# EAGLE design AdaPoon (EAGLE 8.6.3)
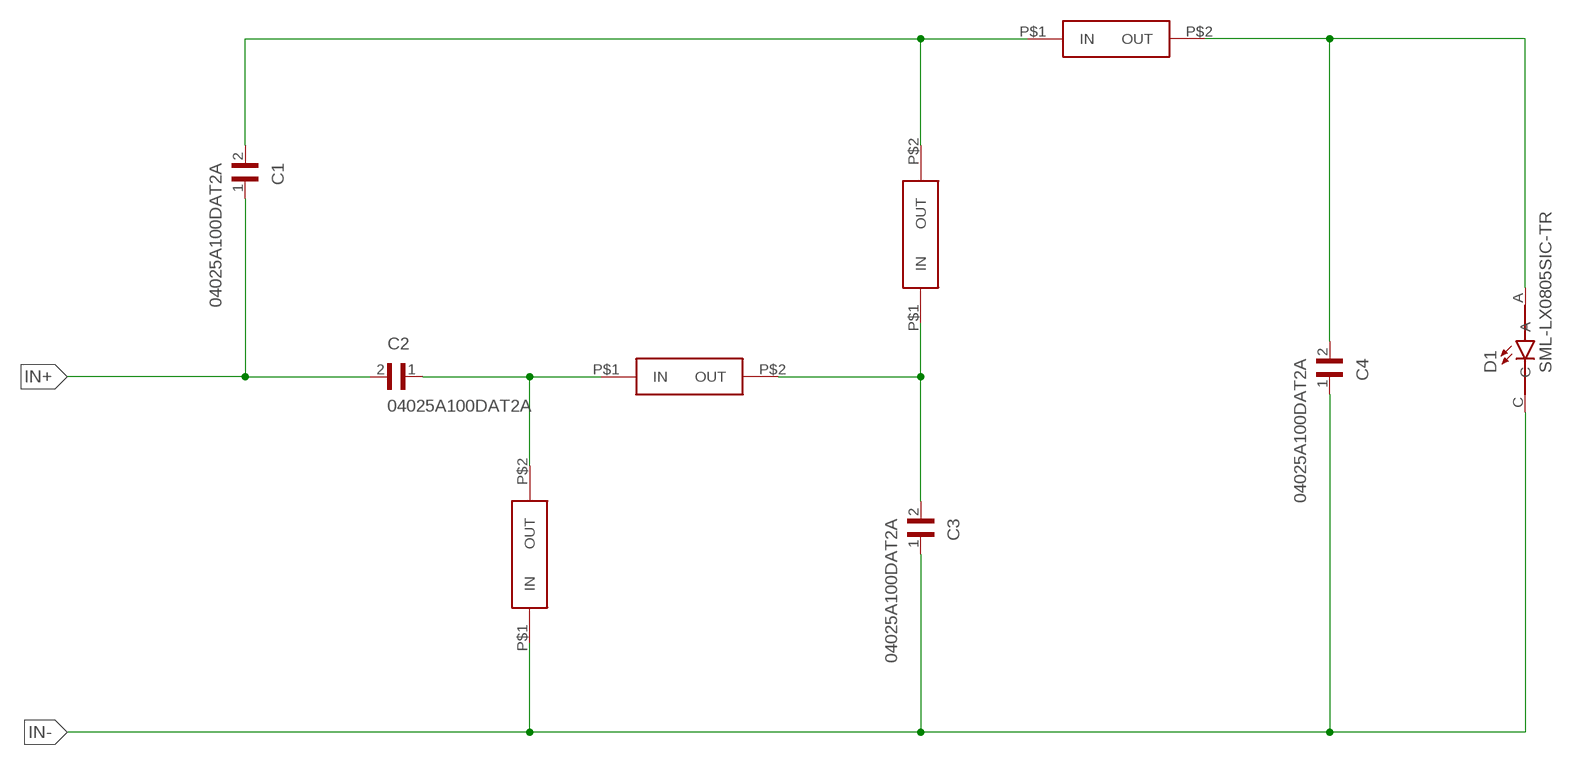
[diagram p0: schematic, sheet 1]

## Parts
C1  04025A100DAT2A  [CAPC1005X56N]
C2  04025A100DAT2A  [CAPC1005X56N]
C3  04025A100DAT2A  [CAPC1005X56N]
C4  04025A100DAT2A  [CAPC1005X56N]
D1  SML-LX0805SIC-TR  [LEDC2012X120N]
U$1  SCHOTTKY0402  [0402_MURATA]
U$2  SCHOTTKY0402  [0402_MURATA]
U$3  SCHOTTKY0402  [0402_MURATA]
U$4  SCHOTTKY0402  [0402_MURATA]

## Nets
IN+: C1.1 C2.2
IN-: C3.1 C4.1 D1.C U$1.P$1(IN)
N$1: C2.1 U$1.P$2(OUT) U$2.P$1(IN)
N$3: C1.2 U$3.P$2(OUT) U$4.P$1(IN)
N$4: C3.2 U$2.P$2(OUT) U$3.P$1(IN)
N$5: C4.2 D1.A U$4.P$2(OUT)

## Library data of the parts
C1-C4 = 04025A100DAT2A:04025A100DAT2A: CAPACITOR, 0402, 10PF, 50V, NP0; Capacitor Application:General Purpose; Dielectric Characteristic:C0G / NP0; Capacitance:10pF; Capacitance Tolerance:± 5%; Voltage Rating:50V; Capacitor Case Style:0402; Capacitor Mounting:SMD; Operating Temperature Range:-55°C to +125°C; SVHC:No SVHC (15-Dec-2010); No. of Pins:2; Operating Temperature Max:125°C; Operating Temperature Min:-55°C; Package / Case:0402; Temperature Coefficient:0 ± 30ppm/°C; Terminal Type:Surface Mount (SMD, SMT); Termination Type:SMD; Tolerance +:5%; Tolerance -:5%; Voltage Rating VDC:50V; AVAILABILITY: Unavailable; DESCRIPTION: Cap Ceramic 10pF 50V C0G 0.5pF SMD 0402 125C Paper T/R; MF: AVX; MP: 04025A100DAT2A; PACKAGE: 0402 AVX Interconnect / Elco; PRICE: None
D1 = SML-LX0805SIC-TR:SML-LX0805SIC-TR: LED, RED, 1.25MM X 1.4MM, 60MCD, 636NM; AVAILABILITY: Unavailable; DESCRIPTION: Super Red 2 x 1.25 mm 0805 140° Water Clear 60 mcd 2 V PCB Surface Mount LED; MF: Lumex Opto/Components; MP: SML-LX0805SIC-TR; PACKAGE: 0805 Lumex; PRICE: None
U$1-U$4 = Schottki_0402:SCHOTTKY0402

## Board
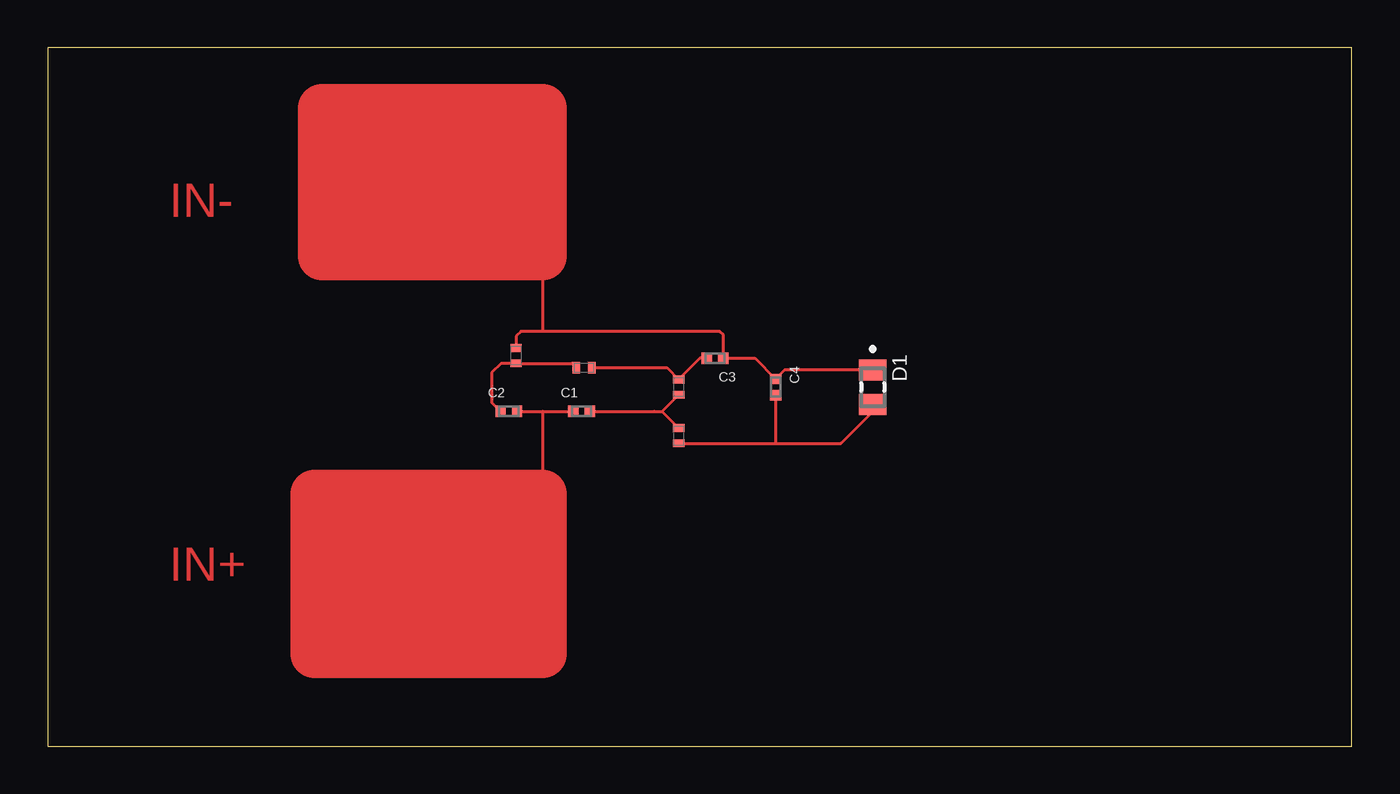
[diagram p1: board, top side]

Size 68.25 x 36.57 mm. Coordinates in mm from the lower left corner, seen from the top.
Outline: 0,0 68.25,0 68.25,36.57 0,36.57 0,0
Copper layers (1*16): Top 0.035mm / dielectric 1.5mm / Bottom 0.035mm
Design rules "default": minimum track width 6mil, minimum drill 0.35mm, track to track 6mil, track to pad 6mil, pad to pad 6mil, via to via 6mil, smd to smd 6mil, copper to edge 40mil, drill to drill 6mil, minimum pad ring 10mil, minimum via ring 8mil, stop-mask expansion 4mil, vias tented up to drill 0mil, thermal gap 10mil

### Footprints (pad centres in the part's own frame; a part is rotated, then mirrored left to right if it is on the bottom)
CAPC1005X56N = smd 0.54 x 0.6: 1 -0.43,0; 2 0.43,0
LEDC2012X120N = smd 1.1 x 1.45: A 0.9,0; C -0.9,0
0402_MURATA = smd 0.4 x 0.6: P$1 -0.4,0; P$2 0.4,0

### Placement (x,y rotation side)
C1  27.94,17.53 0 top
C2  24.13,17.53 0 top
C3  34.92,20.32 180 top
C4  38.1,18.8 270 top
D1  43.18,18.8 270 top
U$1  24.51,20.45 270 top
U$2  28.07,19.81 0 top
U$3  33.02,18.8 270 top
U$4  33.02,16.26 270 top

### Tracks (layer width: path | path; a pad name or v marks a point on that pad's centre or on a via)
IN+
  Top 0.152: C2.2 25.91,17.53 | 25.91,17.53 C1.1 | 25.91,17.53 25.91,13.21
  Top 2.54: 13.97,11.18 13.97,13.21 25.91,13.21 25.91,4.83 13.97,4.83 13.97,11.18 | 13.97,11.18 24.13,11.18 24.13,8.64 | 24.13,6.1 24.13,8.64 | 24.13,8.64 15.24,8.64 15.24,7.37 22.86,7.37
IN-
  Top 0.152: D1.C 38.57,19.7 C4.1 37.01,20.32 C3.1 35.35,21.54 35.18,21.72 25.91,21.72 | 25.91,21.72 24.77,21.72 24.51,21.46 U$1.P$1 | 25.91,25.78 25.91,21.72 | 25.91,26.67 25.91,26.42
  Top 2.54: 15.49,28.07 25.91,28.07 | 25.91,28.07 25.91,26.42 25.91,25.78 25.91,25.65 14.35,25.65 14.35,33.4 25.91,33.4 25.91,29.46 | 25.91,29.46 25.91,28.07 | 25.91,29.46 16.26,29.46 16.26,31.5 24.64,31.5
N$1
  Top 0.152: C2.1 23.24,17.98 23.24,19.56 23.73,20.05 U$1.P$2 27.43,20.05 U$2.P$1
N$3
  Top 0.152: C1.2 31.75,17.53 32.15,17.53 | 32.15,17.53 U$4.P$1 | 32.15,17.53 U$3.P$2
N$4
  Top 0.152: C3.2 34.14,20.32 U$3.P$1 32.4,19.81 U$2.P$2
N$5
  Top 0.152: U$4.P$2 38.1,15.86 | 38.1,15.86 41.51,15.86 43.18,17.53 D1.A | C4.2 38.1,15.86

### Text on the board
Top: IN- | IN+